# EAGLE design bmp180 (EAGLE 6.2)
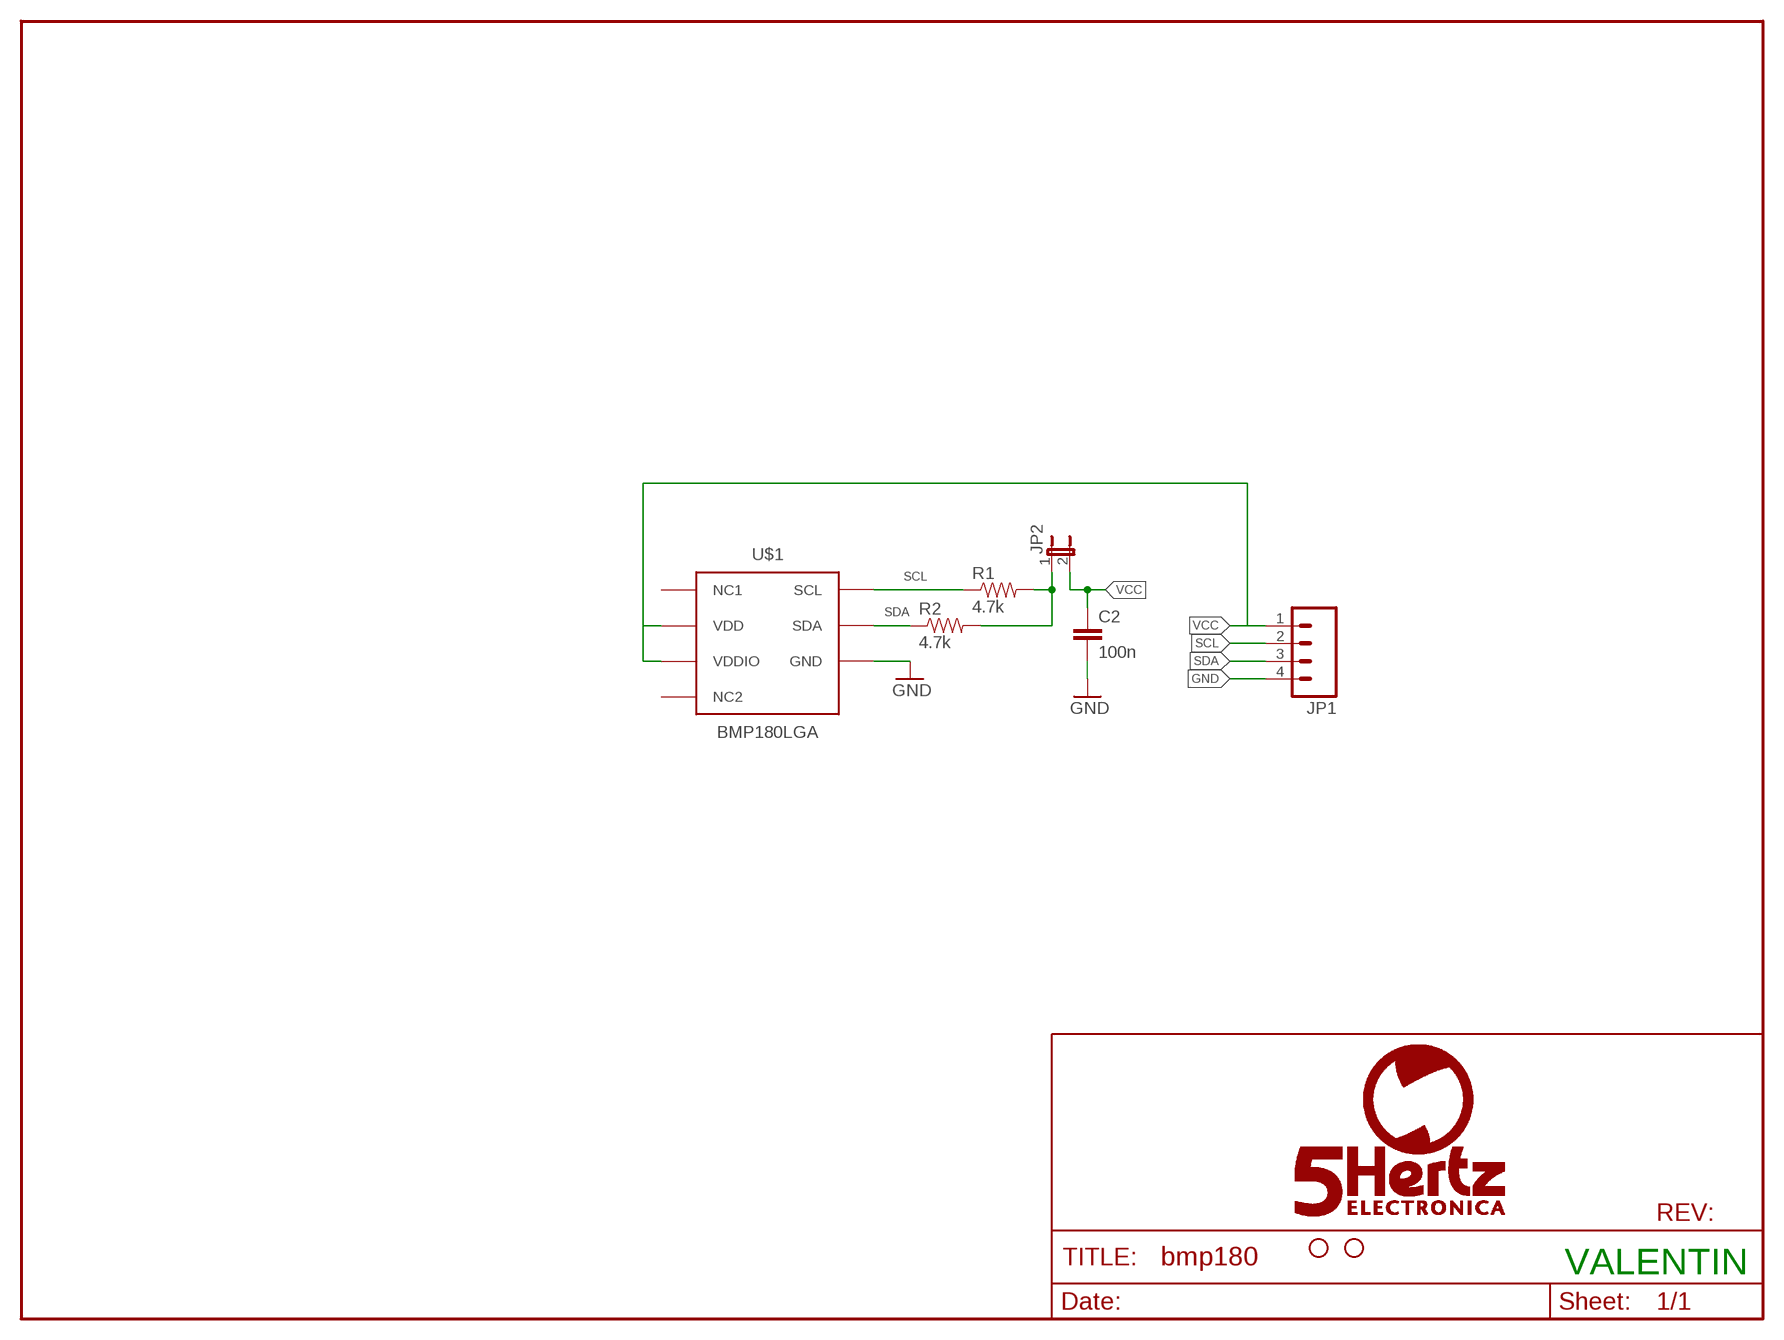
[diagram p0: schematic, sheet 1]

## Parts
C2  100n  CAP0603-CAP  [0603-CAP]
JP1  M04PTH  [1X04]
JP2  JUMPER-2SMD-NO  [SJ_2S-NO]
JP3  STAND-OFFTIGHT  [STAND-OFF-TIGHT]
JP4  STAND-OFFTIGHT  [STAND-OFF-TIGHT]
R1  4.7k  RESISTOR0603-RES  [0603-RES]
R2  4.7k  RESISTOR0603-RES  [0603-RES]
U$1  BMP180LGA  [BMP180_LGA]

## Nets
ASDF: JP2.1 R1.2 R2.2
GND: C2.2 JP1.4 U$1.P$7(GND)
SCL: JP1.2 R1.1 U$1.P$5(SCL)
SDA: JP1.3 R2.1 U$1.P$6(SDA)
VCC: C2.1 JP1.1 JP2.2 U$1.P$2(VDD) U$1.P$3(VDDIO)
Unconnected: U$1.P$1(NC1) U$1.P$4(NC2)

## Notes on the sheet
- VALENTIN

## Library data of the parts
C2 = 5hz-electronica:CAP: Capacitor Standard 0603 ceramic capacitor, and 0.1" leaded capacitor.
JP1 = SparkFun:M04: Header 4 Standard 4-pin 0.1" header. Use with straight break away headers (SKU : PRT-00116), right angle break away headers (PRT-00553), swiss pins (PRT-00743), machine pins (PRT-00117), and female headers (PRT-00115). Molex polarized connector foot print use with SKU : PRT-08231 with associated crimp pins and housings. 1MM SMD Version SKU: PRT-10208
JP2 = SparkFun:JUMPER-2: Jumper Basic 0.1" spaced jumper. Use with breakaway headers.
JP3 JP4 = SparkFun:STAND-OFF: Stand Off This is the mechanical footprint for a #4 phillips button head screw. Use the keepout ring to avoid running the screw head into surrounding components. SKU : PRT-00447
R1 R2 = 5hz-electronica:RESISTOR: Resistor Basic schematic elements and footprints for 0603, 1206, and PTH 1/10th watt (small) resistors.
U$1 = 5hz-electronica:BMP180

## Board
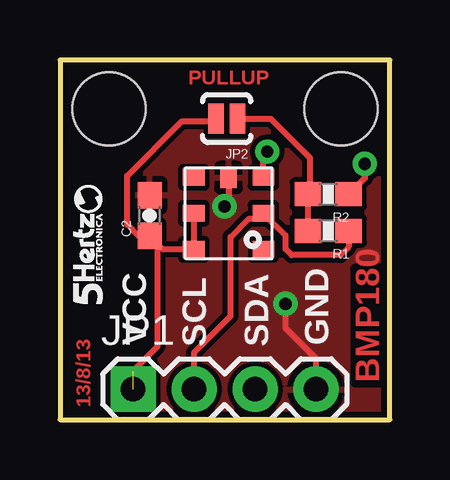
[diagram p1: board, top side]
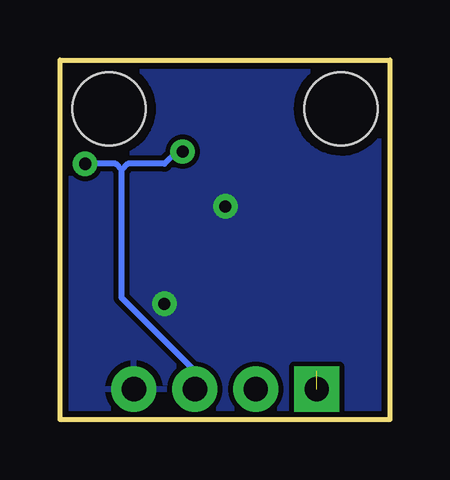
[diagram p2: board, bottom side, seen from below]

Size 13.75 x 15 mm. Coordinates in mm from the lower left corner, seen from the top.
Outline: 0,0 13.75,0 13.75,15 0,15 0,0
Copper layers (1*16): Top 0.035mm / dielectric 1.5mm / Bottom 0.035mm
Design rules: minimum track width 8mil, minimum drill 20mil, track to track 8mil, track to pad 8mil, pad to pad 8mil, via to via 8mil, smd to smd 8mil, copper to edge 10mil, drill to drill 8mil, minimum pad ring 12mil, minimum via ring 10mil, stop-mask expansion 4mil, vias tented up to drill 25mil, thermal gap 10mil

### Footprints (pad centres in the part's own frame; a part is rotated, then mirrored left to right if it is on the bottom)
0603-CAP = smd 1.1 x 1: 1 -0.85,0; 2 0.85,0
1X04 = drill 1.016 pad 1.88 square: 1 0,0 | drill 1.016 pad 1.88: 2 2.54,0; 3 5.08,0; 4 7.62,0
SJ_2S-NO = smd 0.635 x 1.27: 1 -0.45,0; 2 0.45,0
STAND-OFF-TIGHT = hole 3.048: 0,0
0603-RES = smd 1.1 x 1: 1 -0.85,0; 2 0.85,0
BMP180_LGA = smd 0.9 x 0.7: P$1 0.35,3.4; P$2 0.35,1.9; P$3 0.35,0.4; P$4 3.25,0.4; P$5 3.25,1.9; P$6 3.25,3.4 | smd 0.7 x 0.9: P$7 1.8,3.4

### Placement (x,y rotation side)
C2  3.73,8.51 90 top
JP1  3.05,1.27 0 top
JP2  6.95,12.55 180 top
JP3  2.04,12.96 0 top
JP4  11.7,12.96 0 top
R1  11.18,7.87 180 top
R2  11.18,9.4 180 top
U$1  5.22,6.7 0 top
U$2  [5HZ_LOGO_H_5MM]  1.78,4.83 90 top

### Tracks (layer width: path | path; a pad name or v marks a point on that pad's centre or on a via)
ASDF
  Top 0.254: R1.2 R2.2 10.41,9.49 10.41,10.92 8.78,12.55 JP2.1
GND  (via drill 0.51)
  Top 0.254: U$1.P$7 7.02,9.06 v6.86,8.89 | JP1.4 10.67,2.54 9.4,3.81 v9.4,4.83
  pour Top: 0,15 13.75,15 13.75,0 0,0
  pour Bottom: 0,15 13.75,15 13.75,0 0,0
SCL
  Top 0.254: 8.38,8.41 U$1.P$5 | JP1.2 5.59,2.79 7.11,4.32 7.11,7.62 7.87,8.38 8.35,8.38 U$1.P$5 | R1.1 12.03,7.2 11.68,6.86 9.65,6.86 9.4,7.11 9.4,7.68 U$1.P$5
SDA  (via drill 0.51)
  Top 0.254: U$1.P$6 8.47,11.01 v8.64,11.18 | v12.7,10.67 12.7,10.07 R2.1
  Bottom 0.254: JP1.3 8.13,2.03 11.18,5.08 11.18,10.41 | v8.64,11.18 8.89,11.18 9.4,10.67 10.92,10.67 11.18,10.41 | 11.18,10.41 11.43,10.67 v12.7,10.67
VCC  (1 unrouted)
  Top 0.254: 3.05,2.03 4.06,3.05 4.06,7.33 C2.1 | C2.1 3.26,7.66 2.79,8.13 2.79,10.16 5.08,12.45 6.39,12.45 JP2.2 | U$1.P$2 U$1.P$3 4.29,7.1 C2.1

### Text on the board
Top: PULLUP | BMP180 | 13/8/13
tPlace: VCC | SCL | SDA | GND